# EAGLE design New_Multirotor_CPU_imu_V1.3 (EAGLE 6.3)
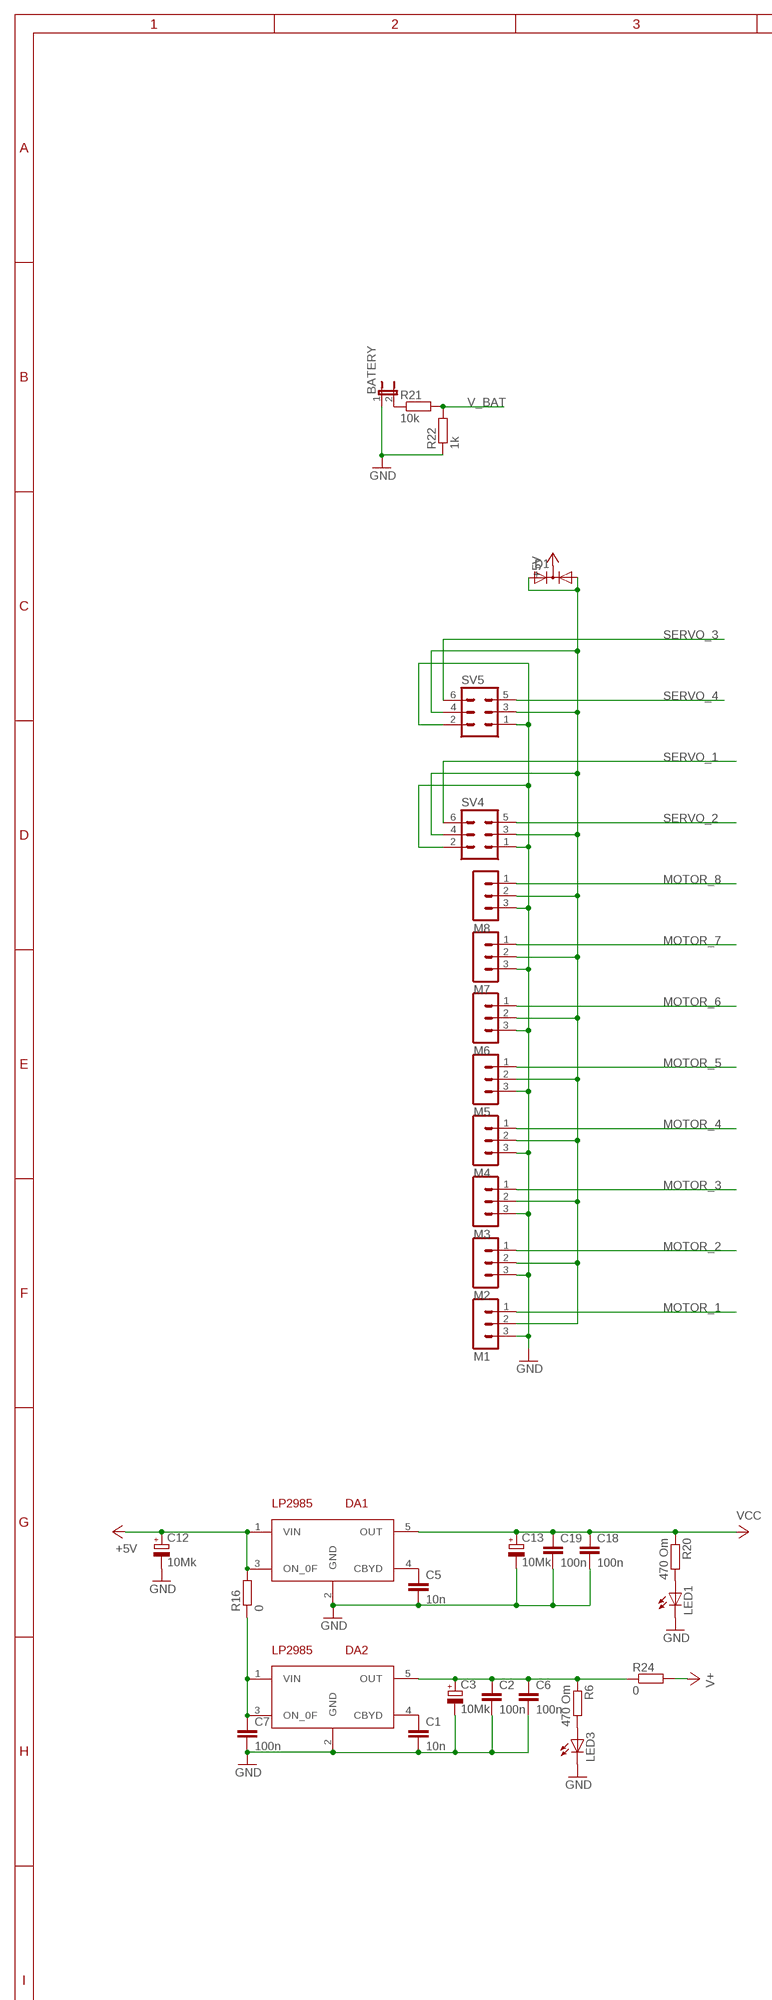
[diagram p0: schematic, sheet 1, part 1 of 2]
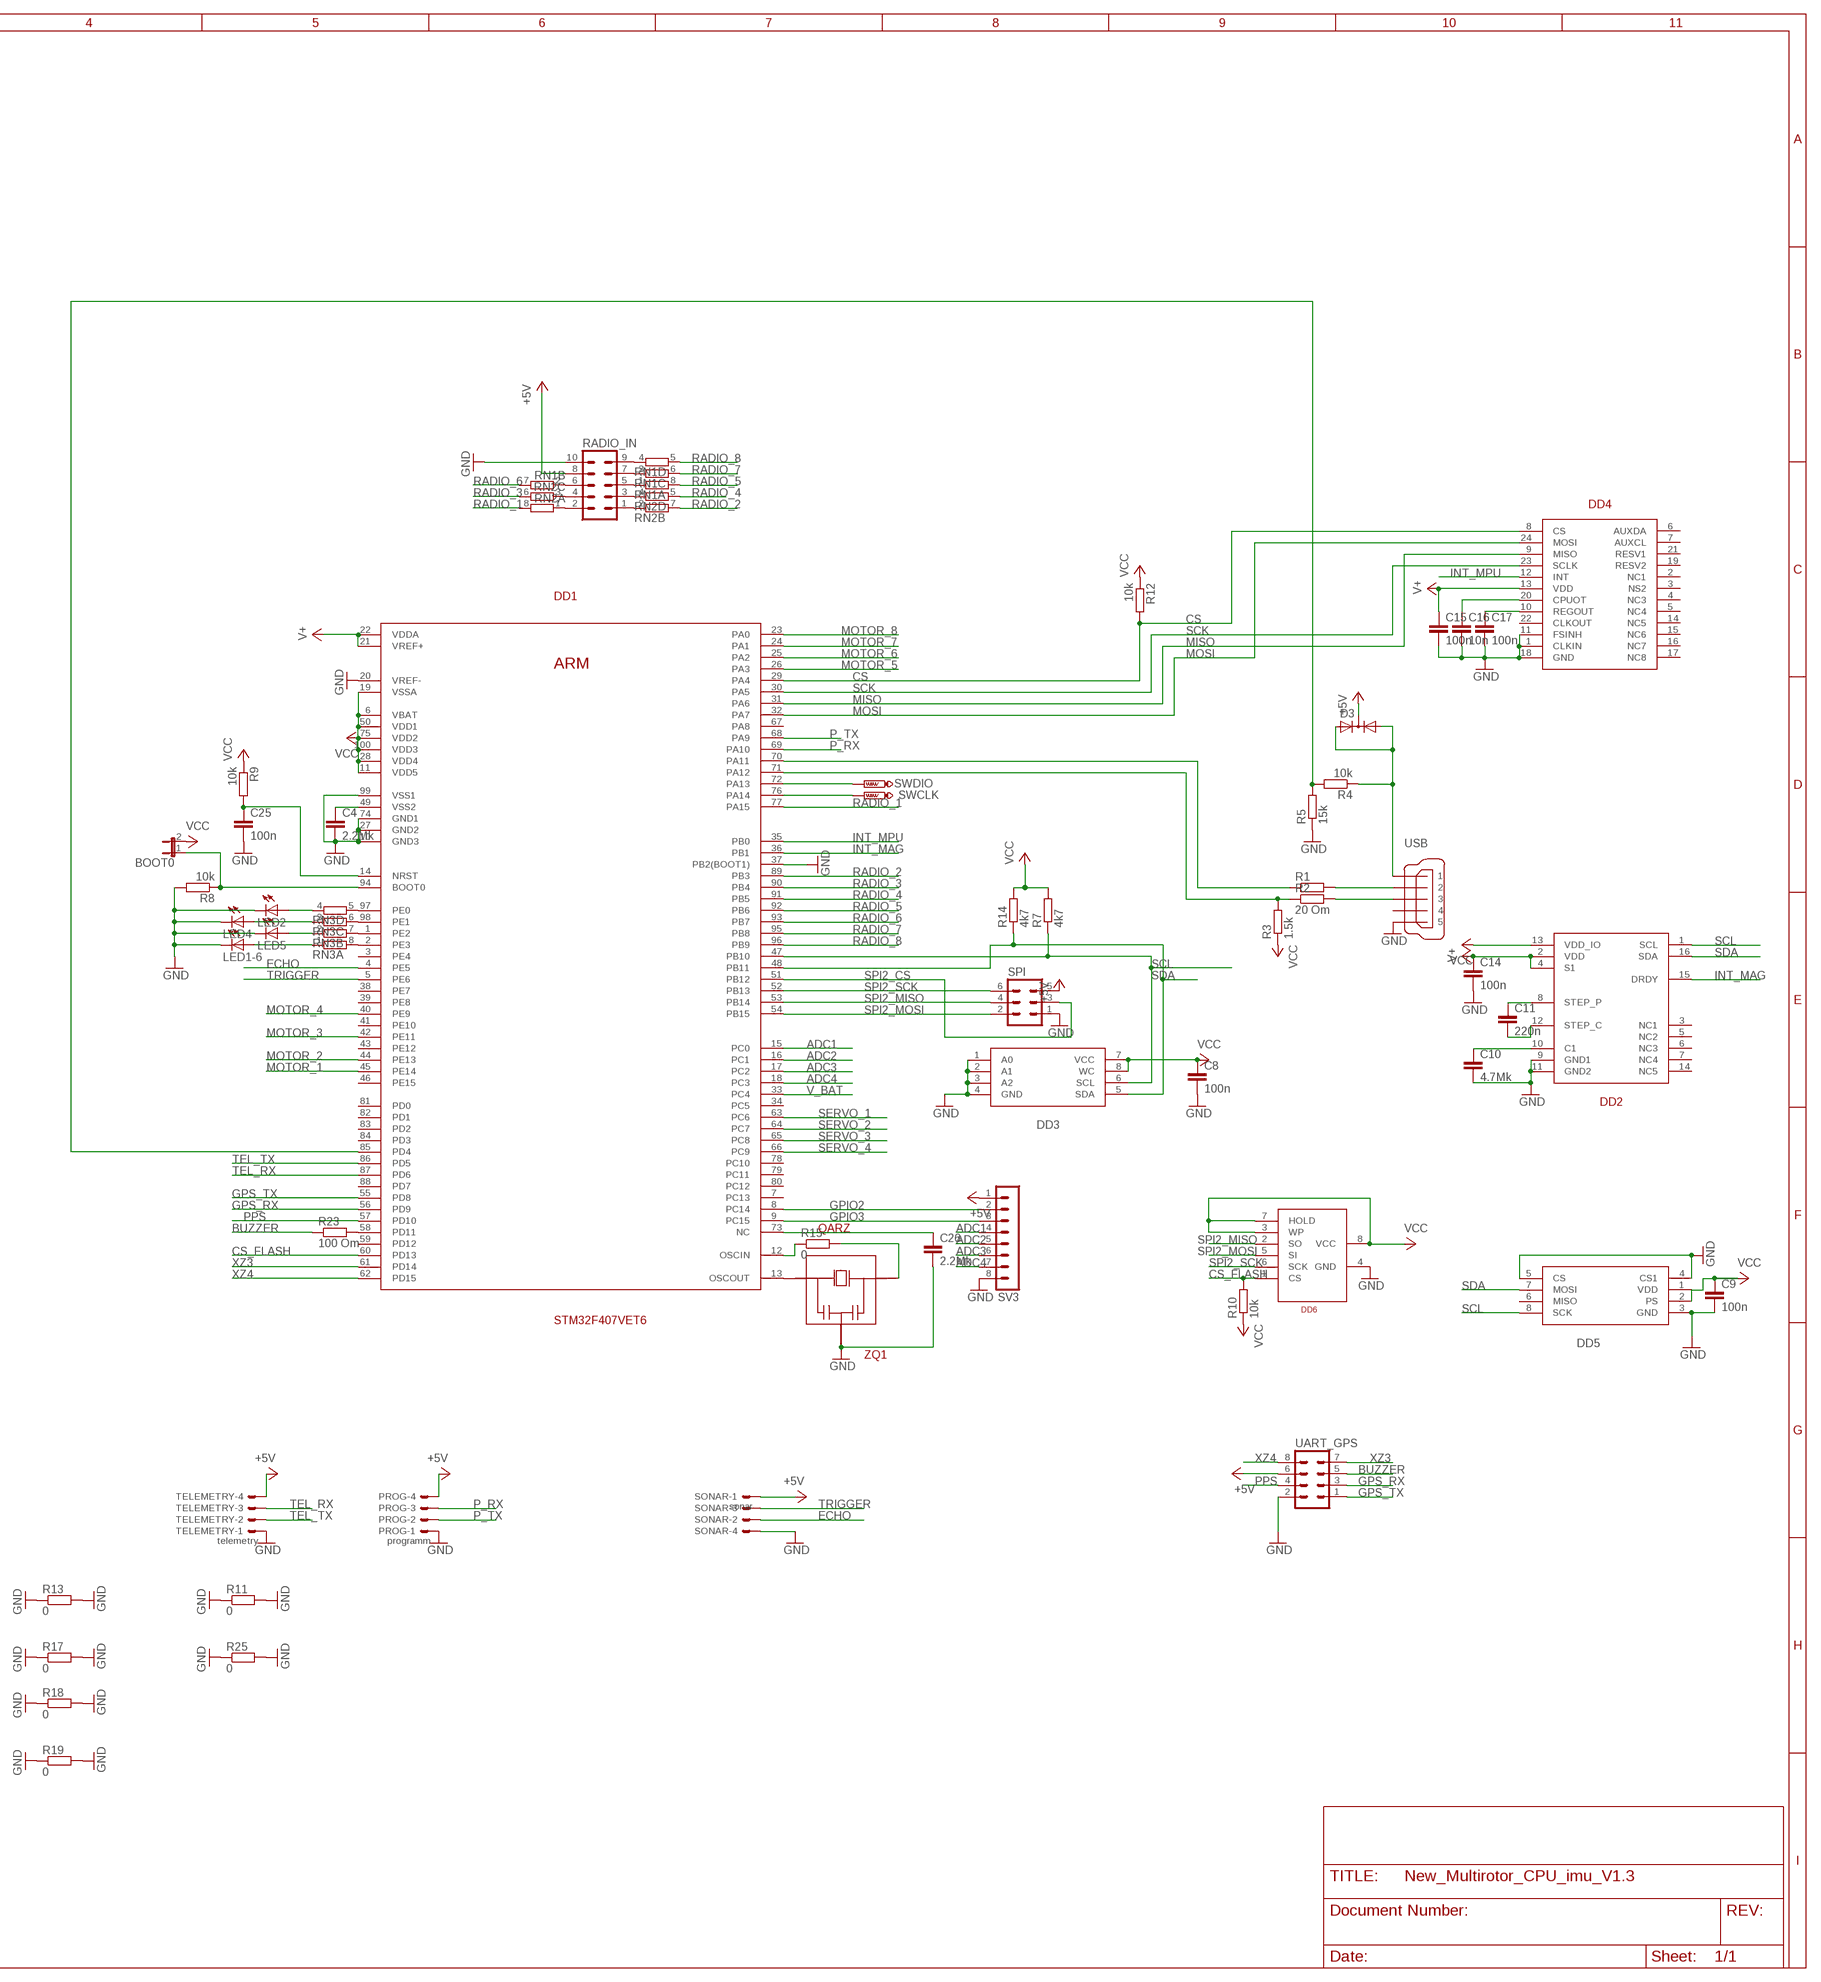
[diagram p1: schematic, sheet 1, part 2 of 2]

## Parts
BATERY  JP1E  [JP1]
BOOT0  JP1E  [JP1]
C1  10n  C-EUC0603K  [C0603K]
C2  100n  C-EUC0603K  [C0603K]
C3  10Mk  CPOL-EUA/3216-18W  [A/3216-18W]
C4  2.2Mk  C-EUC0603K  [C0603K]
C5  10n  C-EUC0603K  [C0603K]
C6  100n  C-EUC0603K  [C0603K]
C7  100n  C-EUC0603K  [C0603K]
C8  100n  C-EUC0603K  [C0603K]
C9  100n  C-EUC0603K  [C0603K]
C10  4.7Mk  C-EUC0603K  [C0603K]
C11  220n  C-EUC0603K  [C0603K]
C12  10Mk  CPOL-EUA/3216-18W  [A/3216-18W]
C13  10Mk  CPOL-EUA/3216-18W  [A/3216-18W]
C14  100n  C-EUC0603K  [C0603K]
C15  100n  C-EUC0603K  [C0603K]
C16  10n  C-EUC0603K  [C0603K]
C17  100n  C-EUC0603K  [C0603K]
C18  100n  C-EUC0603K  [C0603K]
C19  100n  C-EUC0603K  [C0603K]
C25  100n  C-EUC0603K  [C0603K]
C26  2.2Mk  C-EUC0603K  [C0603K]
D1  DIODE-2AC|CASOT23  [SOT23]
D3  DIODE-2AC|CASOT23  [SOT23]
DA1  LP2985  3.3  [SOT23-5L]
DA2  LP2985  3.3  [SOT23-5L]
DD1  STM32F407VET6  [LQFP100]
DD2  HMC5883L  [LCC-16]
DD3  24C512  [SOIC8]
DD4  MPU6000  [JEDEC]
DD5  MS5611-01BA03  [MS5611-01BA03]
DD6  W25X40  [SOIC8]
LED1  LEDCHIPLED_0603  [CHIPLED_0603]
LED1-6  LEDCHIPLED_0603  [CHIPLED_0603]
LED2  LEDCHIPLED_0603  [CHIPLED_0603]
LED3  LEDCHIPLED_0603  [CHIPLED_0603]
LED4  LEDCHIPLED_0603  [CHIPLED_0603]
LED5  LEDCHIPLED_0603  [CHIPLED_0603]
M1  MA03-1  [MA03-1]
M2  MA03-1  [MA03-1]
M3  MA03-1  [MA03-1]
M4  MA03-1  [MA03-1]
M5  MA03-1  [MA03-1]
M6  MA03-1  [MA03-1]
M7  MA03-1  [MA03-1]
M8  MA03-1  [MA03-1]
PROG  programm  SM04B-SRSS-TB  [SM04B-SRSS-TB]
R1  R-EU_R0603  [R0603]
R2  20 Om  R-EU_R0603  [R0603]
R3  1.5k  R-EU_R0603  [R0603]
R4  10k  R-EU_R0603  [R0603]
R5  15k  R-EU_R0603  [R0603]
R6  470 Om  R-EU_R0603  [R0603]
R7  4k7  R-EU_R0603  [R0603]
R8  10k  R-EU_R0603  [R0603]
R9  10k  R-EU_R0603  [R0603]
R10  10k  R-EU_R0603  [R0603]
R11  0  R-EU_R0603  [R0603]
R12  10k  R-EU_R0603  [R0603]
R13  0  R-EU_R0603  [R0603]
R14  4k7  R-EU_R0603  [R0603]
R15  0  R-EU_R0603  [R0603]
R16  0  R-EU_R0603  [R0603]
R17  0  R-EU_R0603  [R0603]
R18  0  R-EU_R0603  [R0603]
R19  0  R-EU_R0603  [R0603]
R20  470 Om  R-EU_R0603  [R0603]
R21  10k  R-EU_R0603  [R0603]
R22  1k  R-EU_R0603  [R0603]
R23  100 Om  R-EU_R0603  [R0603]
R24  0  R-EU_R0603  [R0603]
R25  0  R-EU_R0603  [R0603]
RADIO_IN  MA05-2  [MA05-2]
RN1  4R-N0603-ARV  [0603-ARV]
RN2  4R-N0603-ARV  [0603-ARV]
RN3  4R-N0603-ARV  [0603-ARV]
SONAR  sonar  SM04B-SRSS-TB  [SM04B-SRSS-TB]
SPI  MA03-2  [MA03-2]
SV3  MA08-1  [MA08-1]
SV4  MA03-2  [MA03-2]
SV5  MA03-2  [MA03-2]
SWCLK  PTR1TP12R  [TP12R]
SWDIO  PTR1TP12R  [TP12R]
TELEMETRY  telemetry  SM04B-SRSS-TB  [SM04B-SRSS-TB]
UART_GPS  MA04-2  [MA04-2]
USB  MINI-USB-32005-201  [32005-201]
ZQ1  QARZ  [QARZ]

## Nets
+5V: C12.+ D1.3(C) D3.3(C) DA1.1(VIN) DA1.3(ON_0F) PROG.4 R16.2 RADIO_IN.8 SONAR.1 SPI.5 SV3.1 TELEMETRY.4 UART_GPS.6
ADC1: DD1.15(PC0) SV3.4
ADC2: DD1.16(PC1) SV3.5
ADC3: DD1.17(PC2) SV3.6
ADC4: DD1.18(PC3) SV3.7
BUZZER: R23.1 UART_GPS.5
CS: DD1.29(PA4) DD4.8(CS) R12.2
CS_FLASH: DD1.60(PD13) DD6.1(CS) R10.2
ECHO: DD1.4(PE5) SONAR.2
GND: BATERY.1 C1.2 C2.2 C3.- C4.2 C5.2 C6.2 C7.2 C8.2 C9.2 C10.2 C12.- C13.- C14.2 C15.2 C16.2 C17.2 C18.2 C19.2 C25.2 C26.2 DA1.2(GND) DA2.2(GND) DD1.10(GND3) DD1.20(VREF-) DD1.27(GND2) DD1.37(PB2(BOOT1)) DD1.74(GND1) DD1.99(VSS1) DD2.9(GND1) DD2.11(GND2) DD3.1(A0) DD3.2(A1) DD3.3(A2) DD3.4(GND) DD4.1(CLKIN) DD4.11(FSINH) DD4.18(GND) DD5.3(GND) DD5.4(CS1) DD5.5(CS) DD6.4(GND) LED1-6.C LED1.C LED2.C LED3.C LED4.C LED5.C M1.3 M2.3 M3.3 M4.3 M5.3 M6.3 M7.3 M8.3 PROG.1 R5.1 R8.2 R11.1 R11.2 R13.1 R13.2 R17.1 R17.2 R18.1 R18.2 R19.1 R19.2 R22.1 R25.1 R25.2 RADIO_IN.10 SONAR.4 SPI.1 SV3.8 SV4.1 SV4.2 SV5.1 SV5.2 TELEMETRY.1 UART_GPS.2 USB.5 ZQ1.2
GPIO2: DD1.8(PC14) SV3.2
GPIO3: DD1.9(PC15) SV3.3
GPS_RX: DD1.56(PD9) UART_GPS.3
GPS_TX: DD1.55(PD8) UART_GPS.1
INT_MAG: DD1.36(PB1) DD2.15(DRDY)
INT_MPU: DD1.35(PB0) DD4.12(INT)
MISO: DD1.31(PA6) DD4.9(MISO)
MOSI: DD1.32(PA7) DD4.24(MOSI)
MOTOR_1: DD1.45(PE14) M1.1
MOTOR_2: DD1.44(PE13) M2.1
MOTOR_3: DD1.42(PE11) M3.1
MOTOR_4: DD1.40(PE9) M4.1
MOTOR_5: DD1.26(PA3) M5.1
MOTOR_6: DD1.25(PA2) M6.1
MOTOR_7: DD1.24(PA1) M7.1
MOTOR_8: DD1.23(PA0) M8.1
N$1: DD1.13(OSCOUT) ZQ1.1
N$2: R15.2 ZQ1.3
N$3: DD1.97(PE0) RN3.5
N$4: C1.1 DA2.4(CBYD)
N$5: DD1.98(PE1) RN3.6
N$6: LED3.A R6.2
N$7: C2.1 C3.+ C6.1 DA2.5(OUT) R6.1 R24.1
N$8: RADIO_IN.5 RN1.1
N$9: C7.1 DA2.1(VIN) DA2.3(ON_0F) R16.1
N$10: DD1.1(PE2) RN3.7
N$11: DD1.2(PE3) RN3.8
N$12: DD1.12(OSCIN) R15.1
N$13: LED1.A R20.2
N$14: DD1.72(PA13) SWDIO.TP
N$15: DD1.76(PA14) SWCLK.TP
N$16: LED2.A RN3.4
N$17: LED4.A RN3.3
N$19: C16.1 DD4.20(CPUOT)
N$20: D1.1(A1) D1.2(A2) M1.2 M2.2 M3.2 M4.2 M5.2 M6.2 M7.2 M8.2 SV4.3 SV4.4 SV5.3 SV5.4
N$21: RADIO_IN.3 RN2.4
N$22: C17.1 DD4.10(REGOUT)
N$23: RADIO_IN.9 RN1.4
N$24: RADIO_IN.7 RN1.3
N$25: BATERY.2 R21.1
N$26: C10.1 DD2.10(C1)
N$27: C11.2 DD2.12(STEP_C)
N$28: C11.1 DD2.8(STEP_P)
N$29: DD1.58(PD11) R23.2
N$32: RADIO_IN.6 RN1.2
N$33: RADIO_IN.1 RN2.2
N$34: RADIO_IN.4 RN2.3
N$35: RADIO_IN.2 RN2.1
N$38: LED5.A RN3.2
N$39: LED1-6.A RN3.1
N$41: DD1.70(PA11) R1.1
N$42: DD1.71(PA12) R2.1 R3.2
N$43: R1.2 USB.2
N$44: R2.2 USB.3
N$45: DD1.85(PD4) R4.2 R5.2
N$47: D3.1(A1) D3.2(A2) R4.1 USB.1
N$52: C5.1 DA1.4(CBYD)
N$53: C4.1 DD1.49(VSS2)
N$61: BOOT0.1 DD1.94(BOOT0) R8.1
N$66: C25.1 DD1.14(NRST) R9.2
N$77: C26.1 DD1.73(NC)
P_RX: DD1.69(PA10) PROG.3
P_TX: DD1.68(PA9) PROG.2
PPS: DD1.57(PD10) UART_GPS.4
RADIO_1: DD1.77(PA15) RN2.8
RADIO_2: DD1.89(PB3) RN2.7
RADIO_3: DD1.90(PB4) RN2.6
RADIO_4: DD1.91(PB5) RN2.5
RADIO_5: DD1.92(PB6) RN1.8
RADIO_6: DD1.93(PB7) RN1.7
RADIO_7: DD1.95(PB8) RN1.6
RADIO_8: DD1.96(PB9) RN1.5
SCK: DD1.30(PA5) DD4.23(SCLK)
SCL: DD1.47(PB10) DD2.1(SCL) DD3.6(SCL) DD5.8(SCK) R7.1
SDA: DD1.48(PB11) DD2.16(SDA) DD3.5(SDA) DD5.7(MOSI) R14.1
SERVO_1: DD1.63(PC6) SV4.6
SERVO_2: DD1.64(PC7) SV4.5
SERVO_3: DD1.65(PC8) SV5.6
SERVO_4: DD1.66(PC9) SV5.5
SPI2_CS: DD1.51(PB12) SPI.3
SPI2_MISO: DD1.53(PB14) DD6.2(SO) SPI.4
SPI2_MOSI: DD1.54(PB15) DD6.5(SI) SPI.2
SPI2_SCK: DD1.52(PB13) DD6.6(SCK) SPI.6
TEL_RX: DD1.87(PD6) TELEMETRY.3
TEL_TX: DD1.86(PD5) TELEMETRY.2
TRIGGER: DD1.5(PE6) SONAR.3
V+: C14.1 C15.1 DD1.21(VREF+) DD1.22(VDDA) DD2.2(VDD) DD2.4(S1) DD4.13(VDD) R24.2
V_BAT: DD1.33(PC4) R21.2 R22.2
VCC: BOOT0.2 C8.1 C9.1 C13.+ C18.1 C19.1 DA1.5(OUT) DD1.6(VBAT) DD1.11(VDD5) DD1.19(VSSA) DD1.28(VDD4) DD1.50(VDD1) DD1.75(VDD2) DD1.100(VDD3) DD2.13(VDD_IO) DD3.7(VCC) DD3.8(WC) DD5.1(VDD) DD5.2(PS) DD6.3(WP) DD6.7(HOLD) DD6.8(VCC) R3.1 R7.2 R9.1 R10.1 R12.1 R14.2 R20.1
XZ3: DD1.61(PD14) UART_GPS.7
XZ4: DD1.62(PD15) UART_GPS.8
Unconnected: DD1.3(PE4) DD1.7(PC13) DD1.34(PC5) DD1.38(PE7) DD1.39(PE8) DD1.41(PE10) DD1.43(PE12) DD1.46(PE15) DD1.59(PD12) DD1.67(PA8) DD1.78(PC10) DD1.79(PC11) DD1.80(PC12) DD1.81(PD0) DD1.82(PD1) DD1.83(PD2) DD1.84(PD3) DD1.88(PD7) DD2.3(NC1) DD2.5(NC2) DD2.6(NC3) DD2.7(NC4) DD2.14(NC5) DD4.2(NC1) DD4.3(NS2) DD4.4(NC3) DD4.5(NC4) DD4.6(AUXDA) DD4.7(AUXCL) DD4.14(NC5) DD4.15(NC6) DD4.16(NC7) DD4.17(NC8) DD4.19(RESV2) DD4.21(RESV1) DD4.22(CLKOUT) DD5.6(MISO) USB.4

## Library data of the parts
BATERY BOOT0 = jumper:JP1E: JUMPER
C1 C2 C4-C11 C14-C19 C25 C26 = resistor:C-EU: CAPACITOR, European symbol
C3 C12 C13 = resistor:CPOL-EU: POLARIZED CAPACITOR, European symbol
D1 D3 = diode:DIODE-2AC|CA: Dual DIODE Anode-Cathode|Cathode-Anode
DA1 DA2 = pepelac:3.3
DD1 = pepelac:STM32F407VET6
DD2 = pepelac:HMC5883L
DD3 = pepelac:24C512
DD4 = pepelac:MPU6000
DD5 = pepelac:MS5611-01BA03
DD6 = pepelac:W25X40
LED1 LED1-6 LED2-LED5 = led:LED: LED OSRAM: - CHIPLED LG R971, LG N971, LY N971, LG Q971, LY Q971, LO R971, LY R971 LH N974, LH R974 LS Q976, LO Q976, LY Q976 LO Q996 - Hyper CHIPLED LW Q18S LB Q993, LB Q99A, LB R99A - SideLED LS A670, LO A670, LY A670, LG A670, LP A670 LB A673, LV A673, LT A673, LW A673 LH A674 LY A675 LS A676, LA A676, LO A676, LY A676, LW A676 LS A679, LY A679, LG A679 - Hyper Micro SIDELED® LS Y876, LA Y876, LO Y876, LY Y876 LT Y87S - SmartLED LW L88C, LW L88S LB L89C, LB L89S, LG L890 LS L89K, LO L89K, LY L89K LS L896, LA L896, LO L896, LY L896 - TOPLED LS T670, LO T670, LY T670, LG T670, LP T670 LSG T670, LSP T670, LSY T670, LOP T670, LYG T670 LG T671, LOG T671, LSG T671 LB T673, LV T673, LT T673, LW T673 LH T674 LS T676, LA T676, LO T676, LY T676, LB T676, LH T676, LSB T676, LW T676 LB T67C, LV T67C, LT T67C, LS T67K, LO T67K, LY T67K, LW E67C LS E67B, LA E67B, LO E67B, LY E67B, LB E67C, LV E67C, LT E67C LW T67C LS T679, LY T679, LG T679 LS T770, LO T770, LY T770, LG T770, LP T770 LB T773, LV T773, LT T773, LW T773 LH T774 LS E675, LA E675, LY E675, LS T675 LS T776, LA T776, LO T776, LY T776, LB T776 LHGB T686 LT T68C, LB T68C - Hyper Mini TOPLED® LB M676 - Mini TOPLED Santana® LG M470 LS M47K, LO M47K, LY M47K Source: http://www.osram.convergy.de LUXEON: - LUMILED® LXK2-PW12-R00, LXK2-PW12-S00, LXK2-PW14-U00, LXK2-PW14-V00 LXK2-PM12-R00, LXK2-PM12-S00, LXK2-PM14-U00 LXK2-PE12-Q00, LXK2-PE12-R00, LXK2-PE12-S00, LXK2-PE14-T00, LXK2-PE14-U00 LXK2-PB12-K00, LXK2-PB12-L00, LXK2-PB12-M00, LXK2-PB14-N00, LXK2-PB14-P00, LXK2-PB14-Q00 LXK2-PR12-L00, LXK2-PR12-M00, LXK2-PR14-Q00, LXK2-PR14-R00 LXK2-PD12-Q00, LXK2-PD12-R00, LXK2-PD12-S00 LXK2-PH12-R00, LXK2-PH12-S00 LXK2-PL12-P00, LXK2-PL12-Q00, LXK2-PL12-R00 Source: www.luxeon.com KINGBRIGHT: KA-3528ASYC Source: www.kingbright.com
M1-M8 = con-lstb:MA03-1: PIN HEADER; OC_FARNELL: unknown; OC_NEWARK: unknown
PROG SONAR TELEMETRY = pepelac:?M04B-SRSS-TB: Disconnectable Crimp style connector, 1.0mm pitch 4 contacts
R1-R25 = resistor:R-EU_: RESISTOR, European symbol
RADIO_IN = con-lstb:MA05-2: PIN HEADER; OC_FARNELL: unknown; OC_NEWARK: unknown
RN1-RN3 = resistor-dil:4R-N: Array Chip Resistor Source: RS Component / Phycomp; OC_FARNELL: unknown; OC_NEWARK: unknown
SPI SV4 SV5 = con-lstb:MA03-2: PIN HEADER; OC_FARNELL: unknown; OC_NEWARK: unknown
SV3 = con-lstb:MA08-1: PIN HEADER; OC_FARNELL: unknown; OC_NEWARK: unknown
SWCLK SWDIO = testpad:PTR1: TEST PIN
UART_GPS = con-lstb:MA04-2: PIN HEADER; OC_FARNELL: unknown; OC_NEWARK: unknown
USB = con-cypressindustries:MINI-USB-: MINI USB-B Conector Source: www.cypressindustries.com; OC_FARNELL: unknown; OC_NEWARK: unknown
ZQ1 = pepelac:QARZ

## Net classes
0 Def: width 0.406 mm, clearance 0.152 mm

## Board
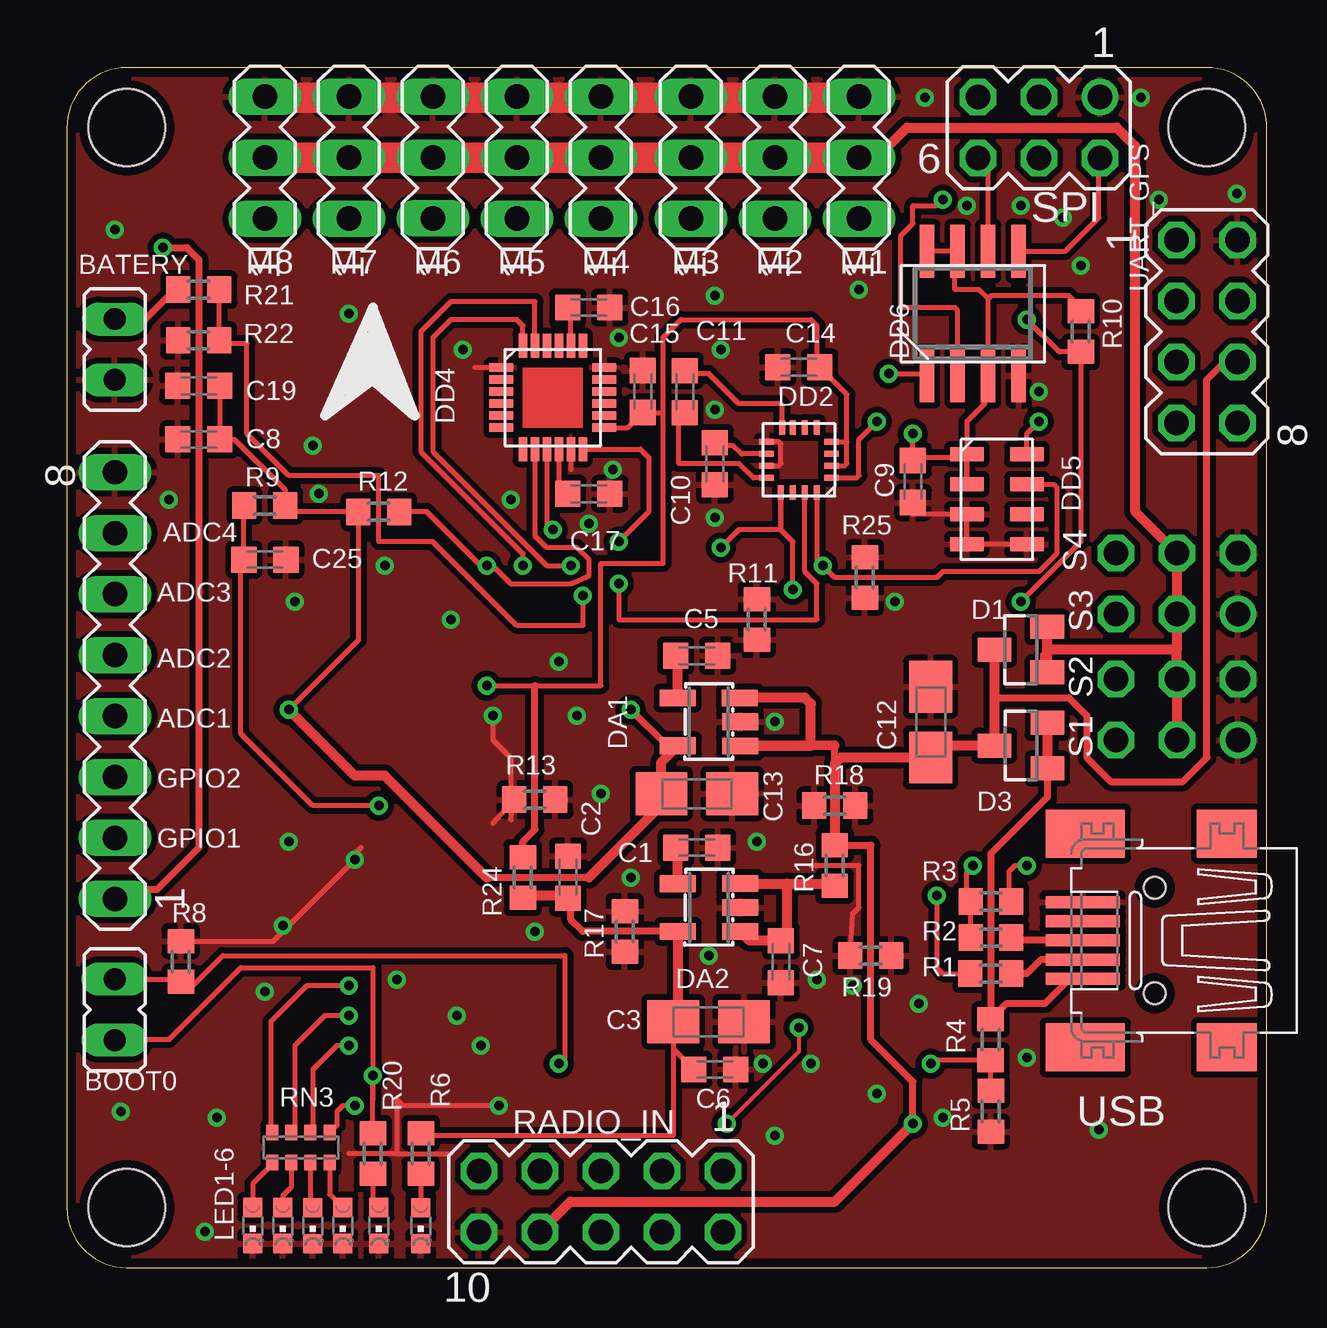
[diagram p2: board, top side]
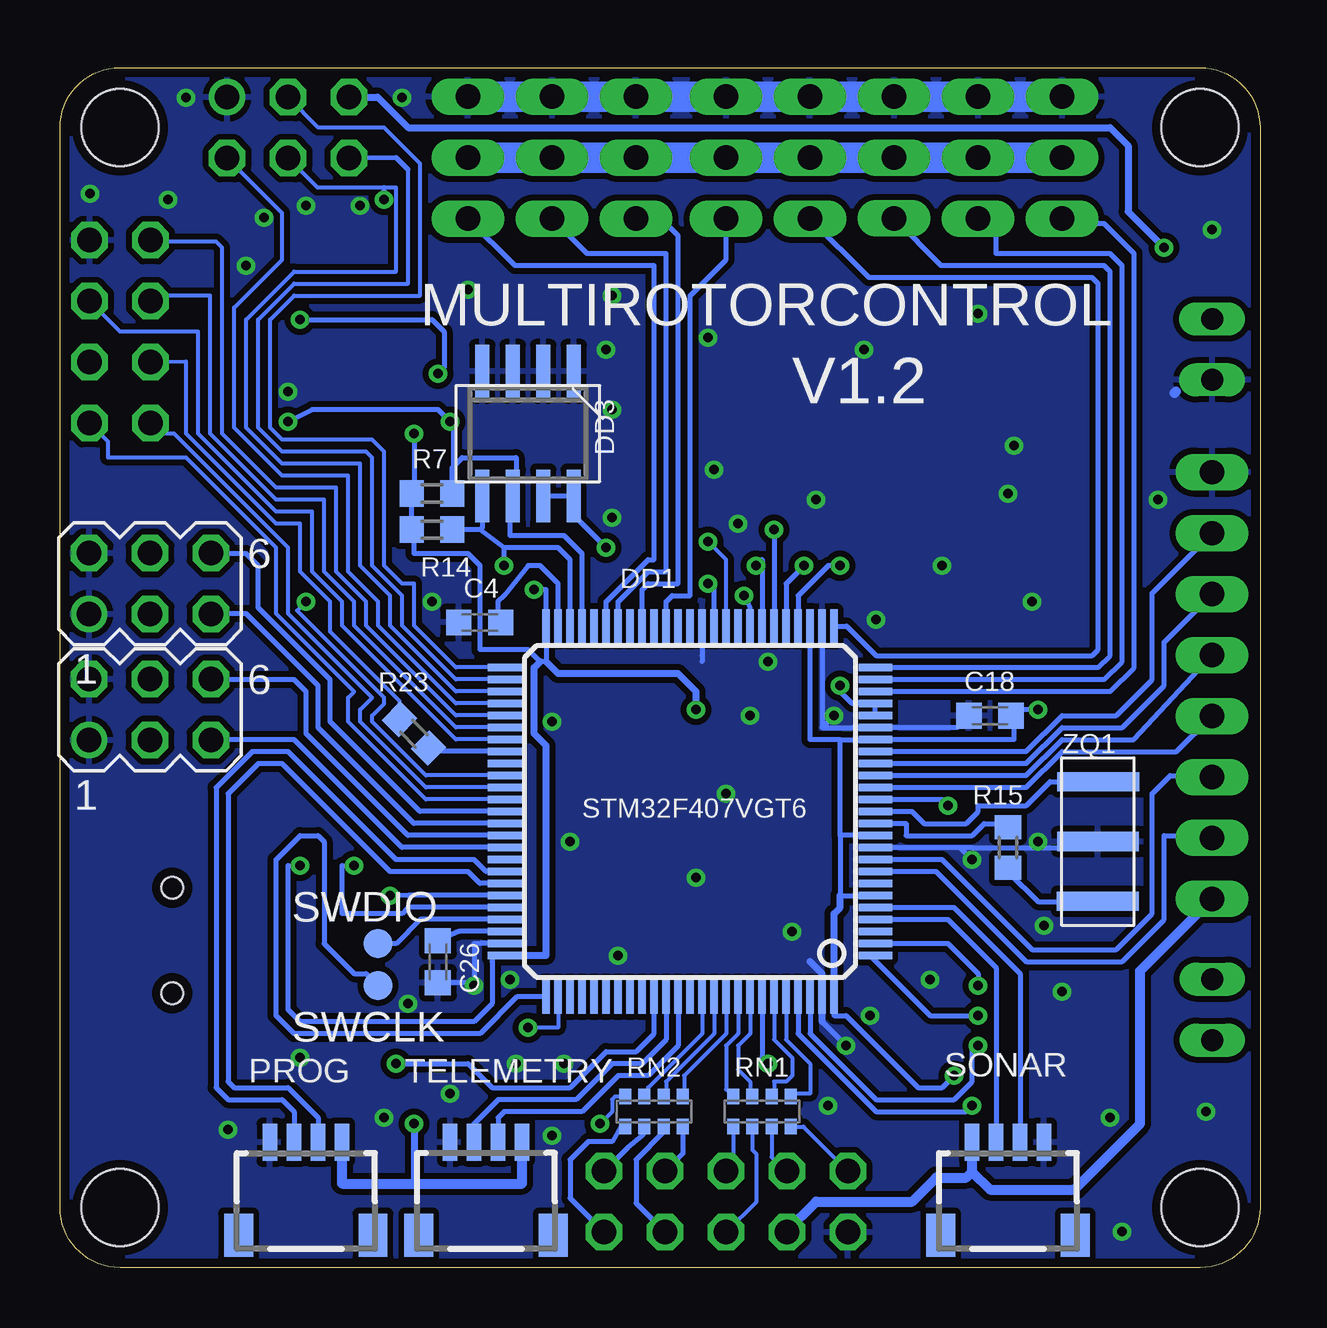
[diagram p3: board, bottom side, seen from below]

Size 50 x 50 mm. Coordinates in mm from the lower left corner, seen from the top.
Outline: 0,47.5 0,2.5 arc90 2.5,0 47.5,0 arc90 50,2.5 50,47.5 arc90 47.5,50 2.5,50 arc90 0,47.5
Copper layers (1*16): Top 0.06mm / dielectric 1.5011mm / Bottom 0.06mm
Design rules "LaenPCBOrder *": minimum track width 6mil, minimum drill 13mil, track to track 6mil, track to pad 6mil, pad to pad 6mil, via to via 6mil, smd to smd 6mil, copper to edge 15mil, drill to drill 6mil, minimum pad ring 7mil, minimum via ring 7mil, stop-mask expansion 4mil, vias tented up to drill 0mil, thermal gap 10mil
Holes 3.2 mm at 2.5,2.5 47.5,2.5 47.5,47.5 2.5,47.5

### Footprints (pad centres in the part's own frame; a part is rotated, then mirrored left to right if it is on the bottom)
JP1 = drill 0.914 long: 1 0,-1.27; 2 0,1.27
C0603K = smd 1.05 x 1.08: 1 -0.875,0; 2 0.875,0
A/3216-18W = smd 2.15 x 1.8: + 1.475,0; - -1.475,0
SOT23 = smd 1 x 1.4: 1 -0.95,-1.1; 2 0.95,-1.1; 3 0,1.1
SOT23-5L = smd 0.7 x 1.5: 1 -1.002,-1.305; 2 0,-1.3; 3 0.997,-1.294; 4 0.991,1.3; 5 -0.998,1.293
LQFP100 = smd 1.4 x 0.3: 1 -7.72,6; 2 -7.72,5.5; 3 -7.72,5; 4 -7.72,4.5; 5 -7.72,4; 6 -7.72,3.5; 7 -7.72,3; 8 -7.72,2.5; 9 -7.72,2; 10 -7.72,1.5; 11 -7.72,1; 12 -7.72,0.5; 13 -7.72,0; 14 -7.72,-0.5; 15 -7.72,-1; 16 -7.72,-1.5; 17 -7.72,-2; 18 -7.72,-2.5; 19 -7.72,-3; 20 -7.72,-3.5; 21 -7.72,-4; 22 -7.72,-4.5; 23 -7.72,-5; 24 -7.72,-5.5; 25 -7.72,-6; 51 7.72,-6; 52 7.72,-5.5; 53 7.72,-5; 54 7.72,-4.5; 55 7.72,-4; 56 7.72,-3.5; 57 7.72,-3; 58 7.72,-2.5; 59 7.72,-2; 60 7.72,-1.5; 61 7.72,-1; 62 7.72,-0.5; 63 7.72,0; 64 7.72,0.5; 65 7.72,1; 66 7.72,1.5; 67 7.72,2; 68 7.72,2.5; 69 7.72,3; 70 7.72,3.5; 71 7.72,4; 72 7.72,4.5; 73 7.72,5; 74 7.72,5.5; 75 7.72,6 | smd 0.3 x 1.4: 26 -6,-7.72; 27 -5.5,-7.72; 28 -5,-7.72; 29 -4.5,-7.72; 30 -4,-7.72; 31 -3.5,-7.72; 32 -3,-7.72; 33 -2.5,-7.72; 34 -2,-7.72; 35 -1.5,-7.72; 36 -1,-7.72; 37 -0.5,-7.72; 38 0,-7.72; 39 0.5,-7.72; 40 1,-7.72; 41 1.5,-7.72; 42 2,-7.72; 43 2.5,-7.72; 44 3,-7.72; 45 3.5,-7.72; 46 4,-7.72; 47 4.5,-7.72; 48 5,-7.72; 49 5.5,-7.72; 50 6,-7.72; 76 6,7.72; 77 5.5,7.72; 78 5,7.72; 79 4.5,7.72; 80 4,7.72; 81 3.5,7.72; 82 3,7.72; 83 2.5,7.72; 84 2,7.72; 85 1.5,7.72; 86 1,7.72; 87 0.5,7.72; 88 0,7.72; 89 -0.5,7.72; 90 -1,7.72; 91 -1.5,7.72; 92 -2,7.72; 93 -2.5,7.72; 94 -3,7.72; 95 -3.5,7.72; 96 -4,7.72; 97 -4.5,7.72; 98 -5,7.72; 99 -5.5,7.72; 100 -6,7.72
LCC-16 = smd 0.6 x 0.25: 1 -1.35,0.85; 2 -1.35,0.35; 3 -1.35,-0.15; 4 -1.35,-0.65; 9 1.35,-0.65; 10 1.35,-0.15; 11 1.35,0.35; 12 1.35,0.85 | smd 0.25 x 0.6: 5 -0.75,-1.25; 6 -0.25,-1.25; 7 0.25,-1.25; 8 0.7,-1.25; 13 0.75,1.45; 14 0.25,1.45; 15 -0.25,1.45; 16 -0.75,1.45
SOIC8 = smd 0.6 x 2.2: 1 -1.905,-2.6; 2 -0.635,-2.6; 3 0.635,-2.6; 4 1.905,-2.6; 5 1.905,2.6; 6 0.635,2.6; 7 -0.635,2.6; 8 -1.905,2.6
JEDEC = smd 1 x 0.35: 1 -2.15,1.25; 2 -2.15,0.75; 3 -2.15,0.25; 4 -2.15,-0.25; 5 -2.15,-0.75; 6 -2.15,-1.25; 13 2.15,-1.25; 14 2.15,-0.75; 15 2.15,-0.25; 16 2.15,0.25; 17 2.15,0.75; 18 2.15,1.25 | smd 0.35 x 1: 7 -1.25,-2.15; 8 -0.75,-2.15; 9 -0.25,-2.15; 10 0.25,-2.15; 11 0.75,-2.15; 12 1.25,-2.15; 19 1.25,2.15; 20 0.75,2.15; 21 0.25,2.15; 22 -0.25,2.15; 23 -0.75,2.15; 24 -1.25,2.15
MS5611-01BA03 = smd 1.4 x 0.6: 1 -1.25,1.875; 2 -1.25,0.625; 3 -1.25,-0.625; 4 -1.25,-1.875; 5 1.25,-1.875; 6 1.25,-0.625; 7 1.25,0.625; 8 1.25,1.875
CHIPLED_0603 = smd 0.8 x 0.8: A 0,-0.75; C 0,0.75
MA03-1 = drill 1.016 long: 1 -2.54,0; 2 0,0; 3 2.54,0
SM04B-SRSS-TB = smd 0.6 x 1.55: 1 -1.5,2.975; 2 -0.5,2.975; 3 0.5,2.975; 4 1.5,2.975 | smd 1.2 x 1.8: FIT@1 -2.8,-0.9; FIT@2 2.8,-0.9
R0603 = smd 1 x 1.1: 1 -0.85,0; 2 0.85,0
MA05-2 = drill 1.016 octagon: 1 -5.08,-1.27; 2 -5.08,1.27; 3 -2.54,-1.27; 4 -2.54,1.27; 5 0,-1.27; 6 0,1.27; 7 2.54,-1.27; 8 2.54,1.27; 9 5.08,-1.27; 10 5.08,1.27
0603-ARV = smd 0.5 x 0.65: 1 -1.2,-0.625; 2 -0.4,-0.625; 3 0.4,-0.625; 4 1.2,-0.625; 5 1.2,0.625; 6 0.4,0.625; 7 -0.4,0.625; 8 -1.2,0.625
MA03-2 = drill 1.016: 1 -2.54,-1.27 | drill 1.016 octagon: 2 -2.54,1.27; 3 0,-1.27; 4 0,1.27; 5 2.54,-1.27; 6 2.54,1.27
MA08-1 = drill 1.016 long: 1 -8.89,0; 2 -6.35,0; 3 -3.81,0; 4 -1.27,0; 5 1.27,0; 6 3.81,0; 7 6.35,0; 8 8.89,0
TP12R = smd 1.2 x 1.2: TP 0,0
MA04-2 = drill 1.016 octagon: 1 -3.81,-1.27; 2 -3.81,1.27; 3 -1.27,-1.27; 4 -1.27,1.27; 5 1.27,-1.27; 6 1.27,1.27; 7 3.81,-1.27; 8 3.81,1.27
32005-201 = smd 3.1 x 0.5: 1 3,1.6; 2 3,0.8; 3 3,0; 4 3,-0.8; 5 3,-1.6 | smd 2.5 x 2: M1 -3,-4.45; M2 -3,4.45 | smd 3.3 x 2: M3 2.9,4.45; M4 2.9,-4.45 | hole 0.9: 0,2.2; 0,-2.2
QARZ = smd 0.8 x 3.4: 1 -2.495,0.01; 2 0,0; 3 2.49,-0.01

### Placement (x,y rotation side)
BATERY  1.99,38.25 0 top
BOOT0  1.99,10.74 180 top
C1  26.25,17.5 0 top
C2  20.88,16.27 90 top
C3  26.74,10.25 180 top
C4  32.51,26.88 180 bottom
C5  26.25,25.5 0 top
C6  27,8.25 0 top
C7  29.75,12.75 270 top
C8  5.5,34.51 180 top
C9  35.25,32.75 270 top
C10  27,33.5 270 top
C11  25.75,36.5 270 top
C12  35.99,22.73 270 top
C13  26.25,19.75 180 top
C14  30.5,37.51 180 top
C15  24,36.5 90 top
C16  21.75,40 0 top
C17  21.75,32.24 0 top
C18  11.25,23 180 bottom
C19  5.5,36.75 180 top
C25  8.25,29.5 0 top
C26  34.25,12.75 270 bottom
D1  39.75,25.75 90 top
D3  39.75,21.75 90 top
DA1  26.75,22.74 90 top
DA2  26.75,15 90 top
DD1  23.75,19 180 bottom
DD2  30.5,33.75 180 top
DD3  30.5,34.75 180 bottom
DD4  20.25,36.25 0 top
DD5  38.75,32.01 0 top
DD6  37.75,39.75 0 top
LED1  13,1.75 180 top
LED1-6  7.75,1.75 180 top
LED2  11.5,1.75 180 top
LED3  14.75,1.75 180 top
LED4  10.25,1.75 180 top
LED5  9,1.75 180 top
M1  33,46.25 90 top
M2  29.5,46.25 90 top
M3  26,46.25 90 top
M4  22.25,46.25 90 top
M5  18.75,46.25 90 top
M6  15.25,46.25 90 top
M7  11.75,46.25 90 top
M8  8.25,46.25 90 top
PROG  39.76,2.25 0 bottom
R1  38.5,12.25 0 top
R2  38.5,13.75 0 top
R3  38.5,15.25 180 top
R4  38.49,9.49 270 top
R5  38.5,6.52 90 top
R6  14.75,4.75 270 top
R7  34.5,32.25 180 bottom
R8  4.75,12.75 90 top
R9  8.25,31.75 180 top
R10  42.25,39 270 top
R11  28.75,27 90 top
R12  13,31.49 0 top
R13  19.5,19.5 180 top
R14  34.5,30.75 180 bottom
R15  10.5,17.5 270 bottom
R16  31.99,16.75 90 top
R17  23.25,14 90 top
R18  32,19.25 0 top
R19  33.5,13 180 top
R20  12.75,4.75 270 top
R21  5.5,40.75 0 top
R22  5.49,38.64 0 top
R23  35.25,22.25 315 bottom
R24  19,16.25 90 top
R25  33.25,28.75 90 top
RADIO_IN  22.25,2.75 180 top
RN1  20.75,6.5 0 bottom
RN2  25.25,6.5 0 bottom
RN3  9.75,5 0 top
SONAR  10.5,2.25 0 bottom
SPI  40.5,47.5 180 top
SV3  2,24.25 90 top
SV4  46.25,28.5 0 bottom
SV5  46.25,23.25 0 bottom
SWCLK  36.75,11.75 0 bottom
SWDIO  36.75,13.5 0 bottom
TELEMETRY  32.25,2.25 0 bottom
UART_GPS  47.5,39 270 top
USB  45.33,13.63 180 top
ZQ1  6.75,17.75 270 bottom

### Tracks (layer width: path | path; a pad name or v marks a point on that pad's centre or on a via)
+5V  (via drill 0.4)
  Top 0.3: 31.99,21.76 R16.2 33.5,17.6 33.5,9.5 35.25,7.75 v35.25,6 | D1.3 38.65,23.85 38.75,23.75 41.75,23.75 42.5,23 42.5,21.25 43.5,20.25 46.5,20.25 47.5,21.25 47.5,37 48.25,37.75 48.75,37.75 UART_GPS.6 | v4,42.5 5,42.5 5.5,42 5.5,17.5 3.75,15.75 2.39,15.75 SV3.1
  Top 0.406: D1.3 D3.3 36.49,21.75 C12.+ 32.25,21.25 32,21 R16.2 | 31.99,21.76 30.25,21.75 28.07,21.75 DA1.1 30.99,21.74 31,21.75 31,23.5 30.75,23.75 28.06,23.75 DA1.3 | v35.25,6 32,2.75 20.98,2.75 RADIO_IN.8
  Bottom 0.3: v35.25,6 35.25,3.5 | SPI.5 36.77,48.77 35.5,47.5 6.25,47.5 5.5,46.75 5.5,44 v4,42.5
  Bottom 0.406: PROG.4 38.26,3.51 38.25,3.5 35.25,3.5 30.75,3.5 TELEMETRY.4 | TELEMETRY.4 | RADIO_IN.8 19.71,1.54 18.5,2.75 14.5,2.75 13.5,3.75 12.25,3.75 12,4 SONAR.1 12,4 11.25,3.25 7.75,3.25 5,6 5,12.36 SV3.1
ADC1
  Bottom 0.2: DD1.15 9.74,20 8.25,21.5 3.48,21.5 SV3.4
ADC2
  Bottom 0.2: DD1.16 9.74,20.5 8.25,22 5.27,22 SV3.5
ADC3
  Bottom 0.2: DD1.17 9.74,21 8.25,22.5 5.75,22.5 4,24.25 4,26.06 SV3.6
ADC4
  Bottom 0.2: DD1.18 9.74,21.5 8.25,23 6,23 4.5,24.5 4.5,28.1 SV3.7
BUZZER
  Bottom 0.16: R23.1 35.85,23.6 38.75,26.5 38.75,27.75 40,29 40,31 41,31 44.75,34.75 44.75,37.75 UART_GPS.5
CS  (via drill 0.4)
  Top 0.2: DD4.8 19.5,30.5 20,30 21.25,30 21.76,29.5 21.76,28.83 21,28.5 18.5,28.5 17.75,29.25 v17.5,29.25 17.25,29.25 15,31.5 13.86,31.5 R12.2
  Bottom 0.2: v17.5,29.25 18,29.25 19.25,28 DD1.29
CS_FLASH  (via drill 0.4)
  Top 0.2: v40,39.5 41.35,38.15 R10.2 42.25,30.25 v39.75,27.75 | v34.25,37.25 35.74,37.25 DD6.1
  Bottom 0.16: DD1.60 34.76,20.5 37,22.75 37,23 36.5,23.5 36.5,23.75 40.12,27.38 v39.75,27.75
  Bottom 0.2: v40,39.5 34.5,39.5 34,39 34,37.5 v34.25,37.25
ECHO
  Bottom 0.2: DD1.4 13.01,14.51 11,12.5 SONAR.2
GND  (via drill 0.4)
  Top 0.2: v17.75,23 17.75,22 18.5,21.25 18.5,18.65 R13.2 17.75,18.5 | 12.25,17.5 12,17.25 v12,17 8.6,13.6 R8.2 | DD4.11 21,33.25 | DD2.11 29.65,33.4 29.75,33.5 29.75,34.32 29.67,34.4 DD2.9 | 18,37.5 17,37.5 | v18,6.75 14,6.75 13.75,7 13.75,4.75 | 13.75,4.75 16,4.75 | 13.75,4.75 11.75,4.75 | R19.2 32.75,14.75 33,15 33,16.75 31,16.75 | DD5.5 DD5.4 DD5.3 35.25,31.39 C9.2
  Top 0.406: 22,48.75 M4.3
  Top 1.27: 8.25,48.75 22,48.75 33,48.75
  Bottom 0.2: ZQ1.2 7,17.5 12,17.5 11.99,17.5 DD1.10 12.51,17.5 v12,17 | C18.2 12.62,22.5 DD1.20 18.25,22.5 | DD1.27 18.25,22.5 | 18.25,22.5 v17.75,23 | DD1.37 23.25,25.5 23.25,25.25 | 18.25,10.25 v17.25,9.25 | DD1.74 32.49,13.51 32.75,13.5 32.75,11.88 C26.2
  Bottom 0.3: 18.75,12.75 18.25,12.25 DD1.99 | 18.25,10.25 DD1.99 | 18.25,11.75 DD1.99
  Bottom 0.406: 7,48.75 M8.3 | 3.5,36.5 3.57,36.44
  Bottom 1.27: M8.3 M7.3 M6.3 M5.3 M4.3 M3.3 M2.3 | M2.3 | M2.3 M1.3
  other vias: 16.5,38.25 11.75,39.75 2,43.25 23,38.75 21.75,31 18.5,32 27,35.75 27.25,38.25 27,31.25 9.5,27.75 13.25,29.25 34.5,27.75 27,40.5 29.5,22.75 28.75,17.75 23.5,16.25 16.25,10.5 6.25,6.25 2.25,6.5 5.75,1.5 13.75,12 29,8.5 31,8.5 36.5,6.25 33.75,7.25 35.5,11 33,40.75 42.25,41.75 48.75,44.75 45.5,44.5 35.75,48.75 40.5,36.5 39.75,44.25 37.5,44.25 41.5,43.75 4.25,32 10.5,32.25 10.25,34.25 21.25,23 19.5,14 22.25,19.75 9,14.25 9.25,17.75 22.75,33.25 31.25,12 40,8.75 26.75,13 32.75,11.75 43,5.75 29.5,5.5 8.25,11.5 16,27 20.5,25.25 44.75,48.75
  pour Top (isolate 0.25): 0,47.5 0,2.5 arc90 2.5,0 46.75,0 arc90 50,2.25 50,47.5 arc90 47.5,50 2.5,50 arc90
  pour Bottom (isolate 0.25): 0,47.5 0,2.5 arc90 2.5,0 46.75,0 arc90 50,2.25 50,47.5 arc90 47.5,50 2.5,50 arc90
GPIO2
  Bottom 0.2: DD1.8 13.51,16.5 9.75,12.75 5.75,12.75 4,14.5 4,18 2.1,18 SV3.2
GPIO3
  Bottom 0.2: DD1.9 13.26,17 9.5,13.25 6,13.25 4.5,14.75 4.5,19.75 3.75,20.5 2.06,20.5 SV3.3
GPS_RX
  Bottom 0.16: DD1.56 33.51,22.5 37.75,26.75 37.75,27.75 39,29 39,32 41,32 43.75,34.75 43.75,40.5 46,40.5 UART_GPS.3
GPS_TX
  Bottom 0.16: DD1.55 33.51,23 37.25,26.75 37.25,27.75 38.5,29 38.5,32.5 41,32.5 43.25,34.75 43.25,42.5 43.5,42.75 46.17,42.75 UART_GPS.1
INT_MAG  (via drill 0.4)
  Top 0.2: v23,28.5 23,27 31.25,27 31.25,28.5 30.75,29 DD2.15
  Bottom 0.2: DD1.36 22.75,28.5 v23,28.5
INT_MPU  (via drill 0.4)
  Top 0.2: DD4.12 23.9,34.1 24.25,33.75 24.25,31.5 v23,30.25
  Bottom 0.16: DD1.35 22.25,29.5 v23,30.25
  Bottom 0.2: DD1.35
MISO  (via drill 0.4)
  Top 0.2: DD4.9 20,31 v20.25,30.75
  Bottom 0.2: v20.25,30.75 DD1.31
MOSI  (via drill 0.4)
  Top 0.2: DD4.24 19,39.25 18.75,39.5 16,39.5 15.25,38.75 15.25,34 20,29.25 v21,29.25
  Bottom 0.2: v21,29.25 20.75,29.5 DD1.32
MOTOR_1
  Bottom 0.2: DD1.45 27.25,27.75 25.5,29.5 25.25,29.5 25.25,41.75 31.04,41.75 M1.1
MOTOR_2
  Bottom 0.2: DD1.44 26.75,27.75 25.5,29 24.75,29 24.75,42.25 28.04,42.25 M2.1
MOTOR_3
  Bottom 0.2: DD1.42 25.75,28.25 25.5,28.5 24.25,28.5 24.25,43 25,43.75 25.96,43.75 M3.1
MOTOR_4
  Bottom 0.2: DD1.40 24.75,27.75 24.5,28 23.75,28 23.75,40.5 22.25,42 M4.1
MOTOR_5
  Bottom 0.2: DD1.26 17.23,26.73 16,25.5 7,25.5 6.75,25.75 6.75,41 7,41.25 16.29,41.25 M5.1
MOTOR_6
  Bottom 0.2: DD1.25 6.75,25 6.25,25.5 6.25,41.5 6.5,41.75 13.29,41.75 M6.1
MOTOR_7
  Bottom 0.2: DD1.24 6.5,24.5 5.75,25.25 5.75,41.75 6.25,42.25 11,42.25 11,42.96 M7.1
MOTOR_8
  Bottom 0.2: DD1.23 6.25,24 5.25,25 5.25,42.25 6.5,43.5 8.04,43.5 M8.1
N$1
  Bottom 0.2: 11.76,19 11.75,19 | 11.75,19 11.75,19.25 9.75,19.25 8.75,20.25 ZQ1.1 | DD1.13 14.51,19 14,18.5 12.25,18.5 11.75,19
N$2
  Bottom 0.2: R15.2 10.5,16.5 9.25,15.25 ZQ1.3 6.77,15.25
N$3  (via drill 0.4)
  Top 0.2: v12,6.75 11.5,6.75 11.25,6.5 11.25,5.92 RN3.5
  Bottom 0.2: DD1.97 19.25,9.75 16,6.5 12.25,6.5 v12,6.75
N$4
  Top 0.406: DA2.4 25.45,17.42 C1.1
N$5  (via drill 0.4)
  Top 0.2: v11.75,9.25 11.25,9.25 10.25,8.25 10.25,5.72 RN3.6
  Bottom 0.2: DD1.98 18.75,9.75 16,7 12.75,7 12,7.75 12,9 v11.75,9.25
N$6
  Top 0.2: R6.2 LED3.A
N$7
  Top 0.2: C6.1 25.27,9.11 C3.+ 25.27,5.52 25.25,5.5 14.85,5.5 R6.1
  Top 0.3: DA2.5 21.49,14.01 21,14.5 21,15.28 C2.1
  Top 0.406: DA2.5 25.46,10.44 C3.+ | R24.1 19,15.5 20.75,15.5 C2.1
N$8
  Bottom 0.16: RN1.1 21.95,4.32 RADIO_IN.5
N$9
  Top 0.406: DA2.3 30,16 | 30,16 30,13.87 C7.1 28.44,13.62 DA2.1 | 30,16 31.89,16 R16.1
N$10  (via drill 0.4)
  Top 0.2: v11.75,10.5 10.75,10.5 9.5,9.25 9.5,5.78 RN3.7
  Bottom 0.2: DD1.1 16.25,13.01 13.75,10.5 v11.75,10.5
N$11  (via drill 0.4)
  Top 0.2: v11.75,11.75 10,11.75 8.5,10.25 8.5,5.67 RN3.8
  Bottom 0.2: DD1.2 13.01,13.51 11.75,12.25 v11.75,11.75
N$12
  Bottom 0.2: DD1.12 14.75,18.5 14.75,18 12,18 11.5,18.5 10.65,18.5 R15.1
N$13
  Top 0.2: R20.2 12.75,2.75 LED1.A
N$14
  Bottom 0.2: DD1.72 34.99,14.51 36,13.5 SWDIO.TP
N$15
  Bottom 0.2: DD1.76 30.96,11.29 32.5,9.75 40.25,9.75 41,10.5 41,17 40,18 39.25,18 39,17.75 39,13.5 37.75,12.25 37.25,12.25 SWCLK.TP
N$16
  Top 0.2: RN3.4 10.95,3.05 LED2.A
N$17
  Top 0.2: RN3.3 10.15,2.6 LED4.A
N$19
  Top 0.2: DD4.20 21,39.88 C16.1
N$20
  Top 0.406: M1.2 33.75,46.25 35,47.5 43.75,47.5 44.5,46.75 44.5,31.52 SV4.4 SV4.3 46.25,25.75 | SV5.3 SV5.4 46.25,25.75 | 46.25,25.75 41,25.75 40.75,25.5 40.75,24.89 D1.1 D1.2 | 22,46.25 M4.2
  Top 1.27: M8.2 22,46.25 M1.2
  Bottom 1.27: M8.2 M7.2 M6.2 M5.2 M4.2 M3.2 M2.2 | M2.2 | M2.2 M1.2
N$21
  Bottom 0.2: RN2.4 24.05,4.76 RADIO_IN.3
N$22
  Top 0.2: DD4.10 20.5,32.62 C17.1
N$23
  Bottom 0.16: RN1.4 19.03,5.88 RADIO_IN.9
N$24
  Bottom 0.16: RN1.3 20.35,4.6 20.25,4.5 20.19,4.5 RADIO_IN.7
N$25
  Top 0.3: R21.1 4.5,40.75 3.25,39.5 2.02,39.5 BATERY.2
N$26
  Top 0.2: DD2.10 28.1,33.9 27.75,34.25 27.12,34.25 C10.1
N$27
  Top 0.2: DD2.12 28.6,32.9 28,33.5 25.5,33.5 25.5,35.62 C11.2
N$28
  Top 0.2: DD2.8 29.8,35.95 29.75,36 28,36 26.75,37.25 25.62,37.25 C11.1
N$29
  Bottom 0.2: DD1.58 34.51,21.5 R23.2
N$32
  Bottom 0.16: RN1.2 21.15,4.9 21,4.75 21,2.73 RADIO_IN.6
N$33
  Bottom 0.2: RN2.2 25.65,5.6 25.75,5.5 26.35,5 RADIO_IN.1
N$34
  Bottom 0.2: RN2.3 24.85,5.65 26,4.5 26,2.69 RADIO_IN.4
N$35
  Bottom 0.2: RN2.1 26.62,5.88 27,5.25 28,5.25 28.75,4.5 28.75,2.9 RADIO_IN.2
N$38
  Top 0.2: RN3.2 9.35,3.35 9,3 LED5.A | LED5.A
N$39
  Top 0.2: RN3.1 8.55,4.3 7.75,3.5 LED1-6.A
N$41  (via drill 0.4)
  Top 0.2: v36.25,15.5 36.25,12.5 36.5,12.25 R1.1
  Bottom 0.2: DD1.70 35.49,15.51 v36.25,15.5
N$42  (via drill 0.4)
  Top 0.2: 37.75,17 v37.75,16.75 37.5,16.5 37.5,15.41 R3.2 R2.1
  Bottom 0.2: DD1.71 35.49,15.01 35.75,14.75 38.25,14.75 38.25,16.75 v37.75,16.75
N$43
  Top 0.3: USB.2 40.58,12.83 40,12.25 R1.2
N$44
  Top 0.3: USB.3 39.47,13.63 R2.2
N$45  (via drill 0.4)
  Top 0.2: R5.2 38.5,8.63 R4.2 36.14,8.64 v36,8.5
  Bottom 0.2: v36,8.5 33,8.5 32,7.5 28.75,7.5 27.25,9 26,9 25.25,9.75 DD1.85
N$47
  Top 0.3: D3.1 40.85,19.6 38.5,17.25 38.5,10.36 R4.1 39.14,11 40.75,11 41.78,12.03 USB.1
  Top 0.406: D3.2 D3.1
N$52
  Top 0.406: DA1.4 25.45,25.42 C5.1
N$53
  Bottom 0.2: DD1.49 29.25,28.5 30,29.25 30.5,29.25 31.5,28 31.75,27.75 31.75,27 C4.1
N$61  (via drill 0.4)
  Top 0.2: BOOT0.1 4.64,12.02 R8.1 4.9,11.75 5.25,11.75 6.5,13 20.75,13 20.75,8.75 v20.5,8.5
  Bottom 0.2: DD1.94 20.75,8.75 v20.5,8.5
N$66  (via drill 0.4)
  Top 0.2: v13,19.25 10.25,19.25 7.25,22.25 7.25,29.38 C25.1 7.38,31.73 R9.2
  Bottom 0.2: DD1.14 13.26,19.5 v13,19.25
N$77
  Bottom 0.2: DD1.73 33.37,14.01 C26.1
P_RX
  Bottom 0.2: DD1.69 32.51,16 33,16.5 36.25,16.5 40.75,21 41.75,21 43,19.75 43,7.75 42.75,7.5 40.5,7.5 39.25,6.25 PROG.3
P_TX
  Bottom 0.2: DD1.68 32.26,16.5 32.75,17 36,17 40.5,21.5 42,21.5 43.5,20 43.5,7.5 43,7 40.75,7 40.25,6.5 PROG.2
PPS
  Bottom 0.16: DD1.57 33.49,22 33.5,22 38.25,26.75 38.25,27.75 39.5,29 39.5,31.5 41,31.5 44.25,34.75 44.25,39 47.5,39 UART_GPS.4
RADIO_1  (via drill 0.4)
  Top 0.16: v30.5,10 30.5,9 v27.5,6
  Bottom 0.16: RN2.8 26.88,7.12 27,7 27,6.5 v27.5,6 | DD1.77 29.25,10 v30.5,10
RADIO_2
  Bottom 0.16: DD1.89 23.25,9.75 25.5,7.5 25.5,7.27 RN2.7
RADIO_3
  Bottom 0.16: DD1.90 22.75,9.75 24.75,7.75 24.75,7.22 RN2.6
RADIO_4
  Bottom 0.16: DD1.91 22.25,9.75 24,8 24,7.17 RN2.5
RADIO_5
  Bottom 0.16: DD1.92 21.75,9.75 22.25,9.25 22.25,7.42 RN1.8
RADIO_6
  Bottom 0.16: DD1.93 21.25,9.75 21.75,9.25 21.75,8.25 21.25,7.75 21.25,7.22 RN1.7
RADIO_7
  Bottom 0.16: DD1.95 20.25,9.5 19.5,8.75 19.5,8 19.75,7.75 20.25,7.75 20.25,7.23 RN1.6
RADIO_8
  Bottom 0.16: DD1.96 19.75,9.5 18.75,8.5 18.75,7.25 19.43,7.25 RN1.5
SCK  (via drill 0.4)
  Top 0.2: DD4.23 19.5,40.25 16,40.25 14.75,39 14.75,34 19,29.75 v19,29.25
  Bottom 0.2: v19,29.25 19.75,28.5 DD1.30
SCL  (via drill 0.4)
  Top 0.2: DD5.8 40,34.75 v40.5,35.25 | DD2.1 32.9,32.9 33,33 33,34.5 v33.75,35.25
  Bottom 0.2: DD1.47 28.25,29.75 29,30.5 31.25,30.5 31.25,32.03 DD3.6 31,32.28 31,33.75 33.25,33.75 33.62,33.38 | R7.1 33.65,33.35 33.62,33.38 | 33.62,33.38 33.62,35.12 v33.75,35.25 34.25,35.75 39.5,35.75 v40.5,35.25
SDA  (via drill 0.4)
  Top 0.2: DD2.16 31.25,29.5 v31.5,29.25 32,28.75 36.25,28.75 36.5,29 40.5,29 41.25,29.75 41.25,32.5 41.11,32.64 DD5.7
  Bottom 0.2: DD1.48 28.75,29 28.75,29.5 29.25,30 31.5,30 | 31.5,30 32.5,30.75 | 32.5,30.75 R14.1 | R14.1 | v31.5,29.25 31.5,30 | DD3.5 32.41,30.84 32.5,30.75
SERVO_1
  Bottom 0.2: DD1.63 35.01,19 38.75,22.75 38.75,24.5 41.75,27.5 41.75,29.25 42.25,29.75 43.69,29.75 SV4.6
SERVO_2
  Bottom 0.2: DD1.64 35.24,18.5 35.25,18.5 39.25,22.5 39.25,24.25 42.25,27.25 43.69,27.25 SV4.5
SERVO_3
  Bottom 0.2: DD1.65 35.51,18 39.75,22.25 39.75,24 40.25,24.5 43.69,24.5 SV5.6
SERVO_4
  Bottom 0.2: DD1.66 35.76,17.5 40.25,22 43.69,22 SV5.5
SPI2_CS
  Bottom 0.16: DD1.51 33.51,25 35.25,26.75 35.25,28.5 35.75,28.5 36.5,29.25 36.5,34 37,34.5 40.75,34.5 41.25,35 41.25,39.5 40.25,40.5 35,40.5 35,46 36.5,47.5 39.23,47.5 SPI.3
SPI2_MISO  (via drill 0.4)
  Top 0.2: DD6.2 37.12,39.88 37,40 34.75,40 34.75,43 35.25,43.5 35.25,44.25 36.25,44.25 v36.5,44.5
  Bottom 0.16: DD1.53 33.51,24 36.25,26.75 36.25,28 37.5,29.25 37.5,33.5 40.75,33.5 42.25,35 42.25,39.5 40.25,41.5 36,41.5 36,45 36.5,45 39.27,45 SPI.4
  Bottom 0.2: v36.5,44.5 36.5,45
SPI2_MOSI
  Top 0.2: DD6.5 41.6,42.35 43,43.75 43,46.19 SPI.2
  Bottom 0.16: DD1.54 33.51,23.5 36.75,26.75 36.75,27.75 38,29 38,33 40.75,33 42.75,35 42.75,40 40.75,42 40.75,43.94 SPI.2
SPI2_SCK
  Top 0.2: DD6.6 38.38,45.8 SPI.6
  Bottom 0.16: DD1.52 33.51,24.5 35.75,26.75 35.75,28 37,29.25 37,33.75 37.25,34 40.75,34 41.75,35 41.75,39.5 40.25,41 35.5,41 35.5,45.75 | 37.73,46 SPI.6
  Bottom 0.2: 35.5,45.75 36,46.25 SPI.6
TEL_RX
  Bottom 0.2: DD1.87 24.25,9.25 25.5,8 26.75,8 28.25,6.5 31.5,6.5 31.75,6.25 TELEMETRY.3
TEL_TX
  Bottom 0.2: DD1.86 24.75,9.5 25.75,8.5 27,8.5 28.5,7 31.75,7 32.75,6 TELEMETRY.2
TRIGGER
  Bottom 0.2: DD1.5 12.76,15.01 10,12.25 SONAR.3
V+  (via drill 0.4)
  Top 0.2: v17.5,24.25 19.5,24.25 22.25,24.25 22.25,29.35 24.85,29.34 24.85,30.5 24.84,30.5 24.84,35.63 | DD2.2 32.4,33.4 32.5,33.5 32.5,34.4 31.95,34.4 DD2.4 32.15,34.4 32.5,34.39 32.5,36.39 C14.1 31.25,37.64 31.25,39.25 31,39.5 25.59,39.5 24.84,38.76 24.84,35.63 | DD4.13 23.37,35 C15.1 24.13,35.63 24.84,35.63
  Top 0.3: R24.2 19,17.75 19.5,18.25 19.5,24.25
  Bottom 0.2: DD1.21 DD1.22 17,23.5 17.5,24 v17.5,24.25
V_BAT  (via drill 0.4)
  Top 0.2: v21.5,28 21.5,26.75 18.75,26.75 15.25,30.25 13,30.25 13,33 9.25,33 7.5,34.75 7.5,38.5 6.48,38.5 R22.2 R21.2
  Bottom 0.2: DD1.33 21.25,27.5 v21.5,28
VCC  (via drill 0.4)
  Top 0.2: v30.25,28.25 30.25,30.25 29.75,30.75 | 29.75,30.75 DD2.13 29.75,30.75 | 29.75,30.75 28,30.75 v27.25,30 | v9.25,23.25 12.15,26.15 R12.1 9.37,31.49 R9.1 9.1,32.4 7,34.5 C8.1 C19.1 | 38.38,40.37 DD6.3 38.25,37.02 38.25,36 37.5,35.25 DD5.1 DD5.2 37.5,33.75 35.25,33.75 C9.1 v35.25,34.75 | 38.38,40.37 38,40.75 37,40.75 37,42.23 DD6.7 DD6.8 | R10.1 42.4,39.85 41.75,40.5 38.52,40.5 38.38,40.37 | R20.1 v12.75,8 | v12.75,8 | BOOT0.2 2.01,9.5 4.25,9.5 7.25,12.5 12.75,12.5 v12.75,8 | v12.75,8 12.75,7 v12.75,8 | v40,16.75 39.5,16.75 39.25,16.5 39.25,15.36 R3.1
  Top 0.3: 21.75,16.25 17.5,16.25 | DA1.5 25.01,21.74 v23.5,23.25
  Top 0.406: DA1.5 24.77,21.06 C13.+ 24.77,19.27 21.75,16.25 | 17.5,16.25 13.25,20.5 12,20.5 v9.25,23.25
  Bottom 0.2: DD1.11 17.5,18 | 17.5,18 17.5,15.5 DD1.6 | 17.5,18 17.5,22 | 17.5,22 DD1.19 10.26,22 10.25,22 10.25,22.87 C18.1 10.12,23.25 v9.25,23.25 | 17.5,22 18.75,22 DD1.28 | v30.25,28.25 29.75,28.25 DD1.50 29.75,25.25 30,25.25 30.5,25.75 32.5,25.75 32.5,29.25 33,29.75 35.25,29.75 35.25,30.65 R14.2 R7.2 35.25,32.75 v35.25,34.75 | v27.25,30 28.5,31.25 28.5,32.05 DD3.8 DD3.7 | DD1.100 17.71,11.25 17.75,10.5 17.25,10.5 14.25,7.5 13.25,7.5 v12.75,8 | DD1.75 32,13.01 32,12.75 32,11 32.75,10.25 40,10.25 40.5,10.75 40.5,16.75 v40,16.75
  Bottom 0.3: DD1.75 29.75,13.01 29.75,13 29.75,21.75 30.25,22.25 30.25,25 30,25.25 | v23.5,23.25 23.5,24 24.25,24.75 29.25,24.75 29.75,25.25 | DD1.100 17.75,14.75 17.5,15 17.5,15.5
XZ3
  Bottom 0.16: DD1.61 34.76,20 37.5,22.75 37.5,23.25 37,23.75 40.5,27.25 40.5,30 45.25,34.75 46.25,34.75 46.17,35.25
  Bottom 0.2: 46.17,35.25 UART_GPS.7
XZ4
  Bottom 0.16: DD1.62 34.76,19.5 38,22.75 38,23.75 37.75,24 41,27.25 41,30 44.75,33.75 48,33.75 48,34.42 UART_GPS.8

### Text on the board
tNames: ADC4 | S4 | ADC3 | S3 | ADC2 | S2 | ADC1 | S1 | GPIO2 | GPIO1
bNames: MULTIROTORCONTROL | V1.2 | STM32F407VGT6